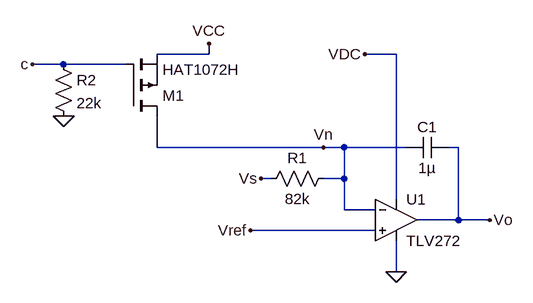
[diagram p0: schematic Integral_Compensator.asc]
Integral_Compensator.asc, the LTspice schematic file:
Version 4
SHEET 1 880 680
WIRE -80 -176 -80 -192
WIRE -80 -176 -160 -176
WIRE 208 -176 160 -176
WIRE -304 -160 -352 -160
WIRE -208 -160 -304 -160
WIRE -160 -32 -160 -80
WIRE 96 -32 -160 -32
WIRE 128 -32 96 -32
WIRE 224 -32 128 -32
WIRE 304 -32 288 -32
WIRE 16 16 0 16
WIRE 128 16 128 -32
WIRE 128 16 96 16
WIRE 208 48 208 -176
WIRE 128 64 128 16
WIRE 176 64 128 64
WIRE 304 80 304 -32
WIRE 304 80 240 80
WIRE 352 80 304 80
WIRE 176 96 -16 96
WIRE 208 160 208 112
FLAG 352 80 Vo
FLAG 0 16 Vs
FLAG -16 96 Vref
FLAG -352 -160 c
FLAG -80 -192 VCC
FLAG 96 -32 Vn
FLAG -304 -80 0
FLAG 208 160 0
FLAG 160 -176 VDC
SYMBOL res 0 32 R270
WINDOW 0 32 56 VTop 2
WINDOW 3 0 56 VBottom 2
SYMATTR InstName R1
SYMATTR Value 82k
SYMBOL cap 224 -16 R270
WINDOW 0 32 32 VTop 2
WINDOW 3 0 32 VBottom 2
SYMATTR InstName C1
SYMATTR Value 1µ
SYMBOL res -320 -176 R0
SYMATTR InstName R2
SYMATTR Value 22k
SYMBOL pmos -208 -80 M180
SYMATTR InstName M1
SYMATTR Value HAT1072H
SYMBOL TLV272 208 80 R0
SYMATTR InstName U1

The netlist it stands for:
* Integral_Compensator.asc
R1 Vs Vn 82k
C1 Vn Vo 1µ
R2 c 0 22k
M1 Vn c VCC VCC HAT1072H
* U1: TLV272 (symbol TLV272 not available, pins judged from their places): In+=Vref In-=Vn V+=VDC V-=0 OUT=Vo
.model NMOS NMOS
.model PMOS PMOS
.lib standard.mos
.backanno
.end